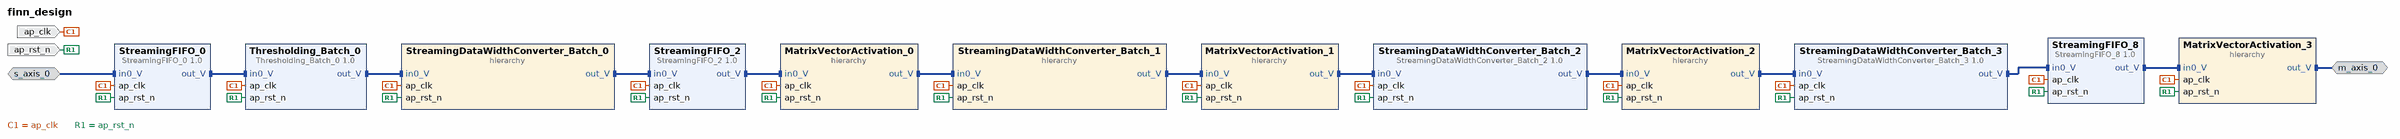
[diagram p0: block diagram of the top level]
# Vivado block design finn_design, xc7z020clg400-1, Vivado 2022.2.2
create_bd_design finn_design

create_bd_intf_port -mode Slave -vlnv xilinx.com:interface:axis_rtl:1.0 s_axis_0
set_property -dict [list \
  CONFIG.FREQ_HZ 100000000.000000 \
  CONFIG.HAS_TKEEP 0 \
  CONFIG.HAS_TLAST 0 \
  CONFIG.HAS_TREADY 1 \
  CONFIG.HAS_TSTRB 0 \
  CONFIG.LAYERED_METADATA undef \
  CONFIG.TDATA_NUM_BYTES 8 \
  CONFIG.TDEST_WIDTH 0 \
  CONFIG.TID_WIDTH 0 \
  CONFIG.TUSER_WIDTH 0 \
] [get_bd_intf_ports s_axis_0]
create_bd_intf_port -mode Master -vlnv xilinx.com:interface:axis_rtl:1.0 m_axis_0
set_property -dict {CONFIG.FREQ_HZ 100000000.000000} [get_bd_intf_ports m_axis_0]
create_bd_port -dir I -type clk ap_clk
set_property -dict {CONFIG.FREQ_HZ 100000000.000000} [get_bd_ports ap_clk]
create_bd_port -dir I -type rst ap_rst_n

create_bd_cell -type ip -vlnv xilinx.com:hls:StreamingFIFO_0:1.0 StreamingFIFO_0
create_bd_cell -type ip -vlnv xilinx.com:hls:Thresholding_Batch_0:1.0 Thresholding_Batch_0
create_bd_cell -type hier StreamingDataWidthConverter_Batch_0
create_bd_cell -type ip -vlnv xilinx.com:hls:StreamingFIFO_2:1.0 StreamingFIFO_2
create_bd_cell -type hier MatrixVectorActivation_0
create_bd_cell -type hier StreamingDataWidthConverter_Batch_1
create_bd_cell -type hier MatrixVectorActivation_1
create_bd_cell -type ip -vlnv xilinx.com:hls:StreamingDataWidthConverter_Batch_2:1.0 StreamingDataWidthConverter_Batch_2
create_bd_cell -type hier MatrixVectorActivation_2
create_bd_cell -type ip -vlnv xilinx.com:hls:StreamingDataWidthConverter_Batch_3:1.0 StreamingDataWidthConverter_Batch_3
create_bd_cell -type ip -vlnv xilinx.com:hls:StreamingFIFO_8:1.0 StreamingFIFO_8
create_bd_cell -type hier MatrixVectorActivation_3

# ---- hierarchy /StreamingDataWidthConverter_Batch_0 ----
current_bd_instance /StreamingDataWidthConverter_Batch_0
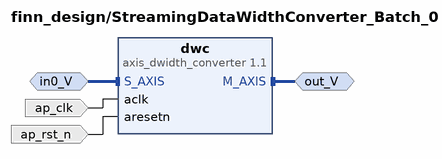
[diagram p1: block diagram inside /StreamingDataWidthConverter_Batch_0]
create_bd_intf_pin -mode Master -vlnv xilinx.com:interface:axis_rtl:1.0 out_V
create_bd_intf_pin -mode Slave -vlnv xilinx.com:interface:axis_rtl:1.0 in0_V
create_bd_pin -dir I -type clk ap_clk
create_bd_pin -dir I -type rst ap_rst_n

create_bd_cell -type ip -vlnv xilinx.com:ip:axis_dwidth_converter:1.1 dwc
set_property -dict {CONFIG.M_TDATA_NUM_BYTES 2 CONFIG.S_TDATA_NUM_BYTES 1} [get_bd_cells dwc]

# ---- hierarchy /MatrixVectorActivation_0 ----
current_bd_instance /MatrixVectorActivation_0
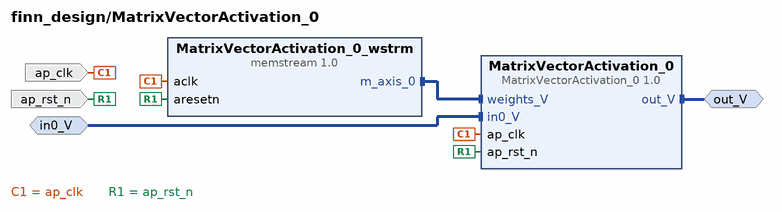
[diagram p2: block diagram inside /MatrixVectorActivation_0]
create_bd_intf_pin -mode Master -vlnv xilinx.com:interface:axis_rtl:1.0 out_V
create_bd_intf_pin -mode Slave -vlnv xilinx.com:interface:axis_rtl:1.0 in0_V
create_bd_pin -dir I -type clk ap_clk
create_bd_pin -dir I -type rst ap_rst_n

create_bd_cell -type ip -vlnv xilinx.com:hls:MatrixVectorActivation_0:1.0 MatrixVectorActivation_0
create_bd_cell -type ip -vlnv xilinx.com:user:memstream:1.0 MatrixVectorActivation_0_wstrm
set_property -dict [list \
  CONFIG.MEM_DEPTH 98 \
  CONFIG.MEM_INIT /tmp/finn_dev_shakeelarkam00/code_gen_ipgen_MatrixVectorActivation_0_qagh72hy/ \
  CONFIG.MEM_WIDTH 512 \
  CONFIG.NSTREAMS 1 \
  CONFIG.RAM_STYLE auto \
  CONFIG.STRM0_DEPTH 98 \
  CONFIG.STRM0_OFFSET 0 \
  CONFIG.STRM0_WIDTH 512 \
] [get_bd_cells MatrixVectorActivation_0_wstrm]

# ---- hierarchy /StreamingDataWidthConverter_Batch_1 ----
current_bd_instance /StreamingDataWidthConverter_Batch_1
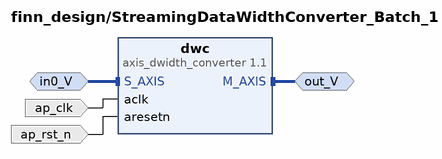
[diagram p3: block diagram inside /StreamingDataWidthConverter_Batch_1]
create_bd_intf_pin -mode Master -vlnv xilinx.com:interface:axis_rtl:1.0 out_V
create_bd_intf_pin -mode Slave -vlnv xilinx.com:interface:axis_rtl:1.0 in0_V
create_bd_pin -dir I -type clk ap_clk
create_bd_pin -dir I -type rst ap_rst_n

create_bd_cell -type ip -vlnv xilinx.com:ip:axis_dwidth_converter:1.1 dwc
set_property -dict {CONFIG.M_TDATA_NUM_BYTES 2 CONFIG.S_TDATA_NUM_BYTES 4} [get_bd_cells dwc]

# ---- hierarchy /MatrixVectorActivation_1 ----
current_bd_instance /MatrixVectorActivation_1
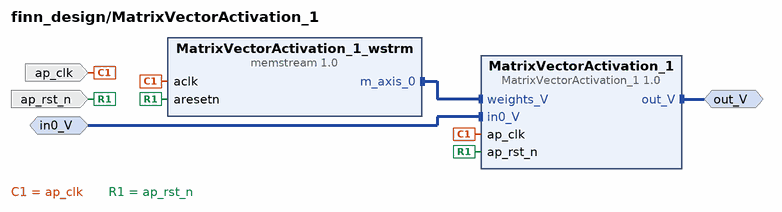
[diagram p4: block diagram inside /MatrixVectorActivation_1]
create_bd_intf_pin -mode Master -vlnv xilinx.com:interface:axis_rtl:1.0 out_V
create_bd_intf_pin -mode Slave -vlnv xilinx.com:interface:axis_rtl:1.0 in0_V
create_bd_pin -dir I -type clk ap_clk
create_bd_pin -dir I -type rst ap_rst_n

create_bd_cell -type ip -vlnv xilinx.com:hls:MatrixVectorActivation_1:1.0 MatrixVectorActivation_1
create_bd_cell -type ip -vlnv xilinx.com:user:memstream:1.0 MatrixVectorActivation_1_wstrm
set_property -dict [list \
  CONFIG.MEM_DEPTH 64 \
  CONFIG.MEM_INIT /tmp/finn_dev_shakeelarkam00/code_gen_ipgen_MatrixVectorActivation_1_9nvtyt7p/ \
  CONFIG.MEM_WIDTH 64 \
  CONFIG.NSTREAMS 1 \
  CONFIG.RAM_STYLE auto \
  CONFIG.STRM0_DEPTH 64 \
  CONFIG.STRM0_OFFSET 0 \
  CONFIG.STRM0_WIDTH 64 \
] [get_bd_cells MatrixVectorActivation_1_wstrm]

# ---- hierarchy /MatrixVectorActivation_2 ----
current_bd_instance /MatrixVectorActivation_2
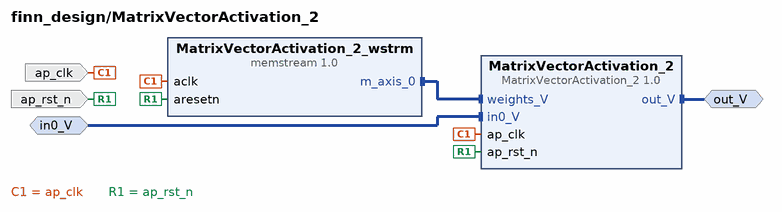
[diagram p5: block diagram inside /MatrixVectorActivation_2]
create_bd_intf_pin -mode Master -vlnv xilinx.com:interface:axis_rtl:1.0 out_V
create_bd_intf_pin -mode Slave -vlnv xilinx.com:interface:axis_rtl:1.0 in0_V
create_bd_pin -dir I -type clk ap_clk
create_bd_pin -dir I -type rst ap_rst_n

create_bd_cell -type ip -vlnv xilinx.com:hls:MatrixVectorActivation_2:1.0 MatrixVectorActivation_2
create_bd_cell -type ip -vlnv xilinx.com:user:memstream:1.0 MatrixVectorActivation_2_wstrm
set_property -dict [list \
  CONFIG.MEM_DEPTH 64 \
  CONFIG.MEM_INIT /tmp/finn_dev_shakeelarkam00/code_gen_ipgen_MatrixVectorActivation_2_aat5dj07/ \
  CONFIG.MEM_WIDTH 64 \
  CONFIG.NSTREAMS 1 \
  CONFIG.RAM_STYLE auto \
  CONFIG.STRM0_DEPTH 64 \
  CONFIG.STRM0_OFFSET 0 \
  CONFIG.STRM0_WIDTH 64 \
] [get_bd_cells MatrixVectorActivation_2_wstrm]

# ---- hierarchy /MatrixVectorActivation_3 ----
current_bd_instance /MatrixVectorActivation_3
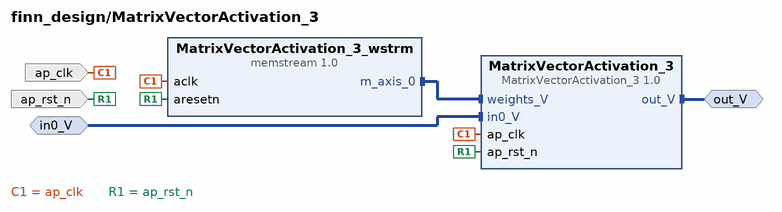
[diagram p6: block diagram inside /MatrixVectorActivation_3]
create_bd_intf_pin -mode Master -vlnv xilinx.com:interface:axis_rtl:1.0 out_V
create_bd_intf_pin -mode Slave -vlnv xilinx.com:interface:axis_rtl:1.0 in0_V
create_bd_pin -dir I -type clk ap_clk
create_bd_pin -dir I -type rst ap_rst_n

create_bd_cell -type ip -vlnv xilinx.com:hls:MatrixVectorActivation_3:1.0 MatrixVectorActivation_3
create_bd_cell -type ip -vlnv xilinx.com:user:memstream:1.0 MatrixVectorActivation_3_wstrm
set_property -dict [list \
  CONFIG.MEM_DEPTH 80 \
  CONFIG.MEM_INIT /tmp/finn_dev_shakeelarkam00/code_gen_ipgen_MatrixVectorActivation_3_up6i7eps/ \
  CONFIG.MEM_WIDTH 8 \
  CONFIG.NSTREAMS 1 \
  CONFIG.RAM_STYLE auto \
  CONFIG.STRM0_DEPTH 80 \
  CONFIG.STRM0_OFFSET 0 \
  CONFIG.STRM0_WIDTH 8 \
] [get_bd_cells MatrixVectorActivation_3_wstrm]

# ---- connections ----

current_bd_instance /StreamingDataWidthConverter_Batch_0
connect_bd_intf_net [get_bd_intf_pins out_V] [get_bd_intf_pins dwc/M_AXIS]
connect_bd_intf_net [get_bd_intf_pins in0_V] [get_bd_intf_pins dwc/S_AXIS]
connect_bd_net [get_bd_pins ap_clk] [get_bd_pins dwc/aclk]
connect_bd_net [get_bd_pins ap_rst_n] [get_bd_pins dwc/aresetn]

current_bd_instance /MatrixVectorActivation_0
connect_bd_intf_net [get_bd_intf_pins out_V] [get_bd_intf_pins MatrixVectorActivation_0/out_V]
connect_bd_intf_net [get_bd_intf_pins MatrixVectorActivation_0_wstrm/m_axis_0] [get_bd_intf_pins MatrixVectorActivation_0/weights_V]
connect_bd_intf_net [get_bd_intf_pins in0_V] [get_bd_intf_pins MatrixVectorActivation_0/in0_V]
connect_bd_net [get_bd_pins ap_clk] [get_bd_pins MatrixVectorActivation_0_wstrm/aclk] [get_bd_pins MatrixVectorActivation_0/ap_clk]
connect_bd_net [get_bd_pins ap_rst_n] [get_bd_pins MatrixVectorActivation_0_wstrm/aresetn] [get_bd_pins MatrixVectorActivation_0/ap_rst_n]

current_bd_instance /StreamingDataWidthConverter_Batch_1
connect_bd_intf_net [get_bd_intf_pins out_V] [get_bd_intf_pins dwc/M_AXIS]
connect_bd_intf_net [get_bd_intf_pins in0_V] [get_bd_intf_pins dwc/S_AXIS]
connect_bd_net [get_bd_pins ap_clk] [get_bd_pins dwc/aclk]
connect_bd_net [get_bd_pins ap_rst_n] [get_bd_pins dwc/aresetn]

current_bd_instance /MatrixVectorActivation_1
connect_bd_intf_net [get_bd_intf_pins out_V] [get_bd_intf_pins MatrixVectorActivation_1/out_V]
connect_bd_intf_net [get_bd_intf_pins MatrixVectorActivation_1_wstrm/m_axis_0] [get_bd_intf_pins MatrixVectorActivation_1/weights_V]
connect_bd_intf_net [get_bd_intf_pins in0_V] [get_bd_intf_pins MatrixVectorActivation_1/in0_V]
connect_bd_net [get_bd_pins ap_clk] [get_bd_pins MatrixVectorActivation_1_wstrm/aclk] [get_bd_pins MatrixVectorActivation_1/ap_clk]
connect_bd_net [get_bd_pins ap_rst_n] [get_bd_pins MatrixVectorActivation_1_wstrm/aresetn] [get_bd_pins MatrixVectorActivation_1/ap_rst_n]

current_bd_instance /MatrixVectorActivation_2
connect_bd_intf_net [get_bd_intf_pins out_V] [get_bd_intf_pins MatrixVectorActivation_2/out_V]
connect_bd_intf_net [get_bd_intf_pins MatrixVectorActivation_2_wstrm/m_axis_0] [get_bd_intf_pins MatrixVectorActivation_2/weights_V]
connect_bd_intf_net [get_bd_intf_pins in0_V] [get_bd_intf_pins MatrixVectorActivation_2/in0_V]
connect_bd_net [get_bd_pins ap_clk] [get_bd_pins MatrixVectorActivation_2_wstrm/aclk] [get_bd_pins MatrixVectorActivation_2/ap_clk]
connect_bd_net [get_bd_pins ap_rst_n] [get_bd_pins MatrixVectorActivation_2_wstrm/aresetn] [get_bd_pins MatrixVectorActivation_2/ap_rst_n]

current_bd_instance /MatrixVectorActivation_3
connect_bd_intf_net [get_bd_intf_pins out_V] [get_bd_intf_pins MatrixVectorActivation_3/out_V]
connect_bd_intf_net [get_bd_intf_pins MatrixVectorActivation_3_wstrm/m_axis_0] [get_bd_intf_pins MatrixVectorActivation_3/weights_V]
connect_bd_intf_net [get_bd_intf_pins in0_V] [get_bd_intf_pins MatrixVectorActivation_3/in0_V]
connect_bd_net [get_bd_pins ap_clk] [get_bd_pins MatrixVectorActivation_3_wstrm/aclk] [get_bd_pins MatrixVectorActivation_3/ap_clk]
connect_bd_net [get_bd_pins ap_rst_n] [get_bd_pins MatrixVectorActivation_3_wstrm/aresetn] [get_bd_pins MatrixVectorActivation_3/ap_rst_n]

current_bd_instance /
connect_bd_intf_net [get_bd_intf_pins MatrixVectorActivation_0/out_V] [get_bd_intf_pins StreamingDataWidthConverter_Batch_1/in0_V]
connect_bd_intf_net [get_bd_intf_pins MatrixVectorActivation_1/out_V] [get_bd_intf_pins StreamingDataWidthConverter_Batch_2/in0_V]
connect_bd_intf_net [get_bd_intf_pins MatrixVectorActivation_2/out_V] [get_bd_intf_pins StreamingDataWidthConverter_Batch_3/in0_V]
connect_bd_intf_net [get_bd_intf_ports m_axis_0] [get_bd_intf_pins MatrixVectorActivation_3/out_V]
connect_bd_intf_net [get_bd_intf_pins StreamingDataWidthConverter_Batch_0/out_V] [get_bd_intf_pins StreamingFIFO_2/in0_V]
connect_bd_intf_net [get_bd_intf_pins StreamingDataWidthConverter_Batch_1/out_V] [get_bd_intf_pins MatrixVectorActivation_1/in0_V]
connect_bd_intf_net [get_bd_intf_pins StreamingDataWidthConverter_Batch_2/out_V] [get_bd_intf_pins MatrixVectorActivation_2/in0_V]
connect_bd_intf_net [get_bd_intf_pins StreamingDataWidthConverter_Batch_3/out_V] [get_bd_intf_pins StreamingFIFO_8/in0_V]
connect_bd_intf_net [get_bd_intf_pins StreamingFIFO_0/out_V] [get_bd_intf_pins Thresholding_Batch_0/in0_V]
connect_bd_intf_net [get_bd_intf_pins StreamingFIFO_2/out_V] [get_bd_intf_pins MatrixVectorActivation_0/in0_V]
connect_bd_intf_net [get_bd_intf_pins StreamingFIFO_8/out_V] [get_bd_intf_pins MatrixVectorActivation_3/in0_V]
connect_bd_intf_net [get_bd_intf_pins Thresholding_Batch_0/out_V] [get_bd_intf_pins StreamingDataWidthConverter_Batch_0/in0_V]
connect_bd_intf_net -intf_net in0_V_0_1 [get_bd_intf_ports s_axis_0] [get_bd_intf_pins StreamingFIFO_0/in0_V]
connect_bd_net -net ap_clk_0_1 [get_bd_ports ap_clk] \
  [get_bd_pins StreamingFIFO_0/ap_clk] [get_bd_pins Thresholding_Batch_0/ap_clk] \
  [get_bd_pins StreamingDataWidthConverter_Batch_0/ap_clk] [get_bd_pins StreamingFIFO_2/ap_clk] \
  [get_bd_pins MatrixVectorActivation_0/ap_clk] [get_bd_pins StreamingDataWidthConverter_Batch_1/ap_clk] \
  [get_bd_pins MatrixVectorActivation_1/ap_clk] [get_bd_pins StreamingDataWidthConverter_Batch_2/ap_clk] \
  [get_bd_pins MatrixVectorActivation_2/ap_clk] [get_bd_pins StreamingDataWidthConverter_Batch_3/ap_clk] \
  [get_bd_pins StreamingFIFO_8/ap_clk] [get_bd_pins MatrixVectorActivation_3/ap_clk]
connect_bd_net -net ap_rst_n_0_1 [get_bd_ports ap_rst_n] \
  [get_bd_pins StreamingFIFO_0/ap_rst_n] [get_bd_pins Thresholding_Batch_0/ap_rst_n] \
  [get_bd_pins StreamingDataWidthConverter_Batch_0/ap_rst_n] [get_bd_pins StreamingFIFO_2/ap_rst_n] \
  [get_bd_pins MatrixVectorActivation_0/ap_rst_n] [get_bd_pins StreamingDataWidthConverter_Batch_1/ap_rst_n] \
  [get_bd_pins MatrixVectorActivation_1/ap_rst_n] [get_bd_pins StreamingDataWidthConverter_Batch_2/ap_rst_n] \
  [get_bd_pins MatrixVectorActivation_2/ap_rst_n] [get_bd_pins StreamingDataWidthConverter_Batch_3/ap_rst_n] \
  [get_bd_pins StreamingFIFO_8/ap_rst_n] [get_bd_pins MatrixVectorActivation_3/ap_rst_n]

validate_bd_design
save_bd_design
